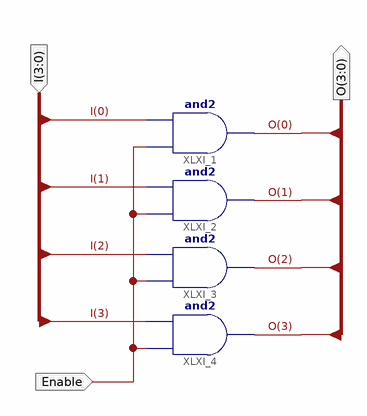
[diagram p0: schematic sheet 1]
// Xilinx ISE schematic buf4be.sch (spartan6) as structural Verilog: 4 symbols, 3 ports
module buf4be (
  input  Enable,
  input  [3:0] I,
  output [3:0] O
);

  and XLXI_1 (O[0], Enable, I[0]);
  and XLXI_2 (O[1], Enable, I[1]);
  and XLXI_3 (O[2], Enable, I[2]);
  and XLXI_4 (O[3], Enable, I[3]);
endmodule
